# Altium project SimpleNCPower.PrjPcb
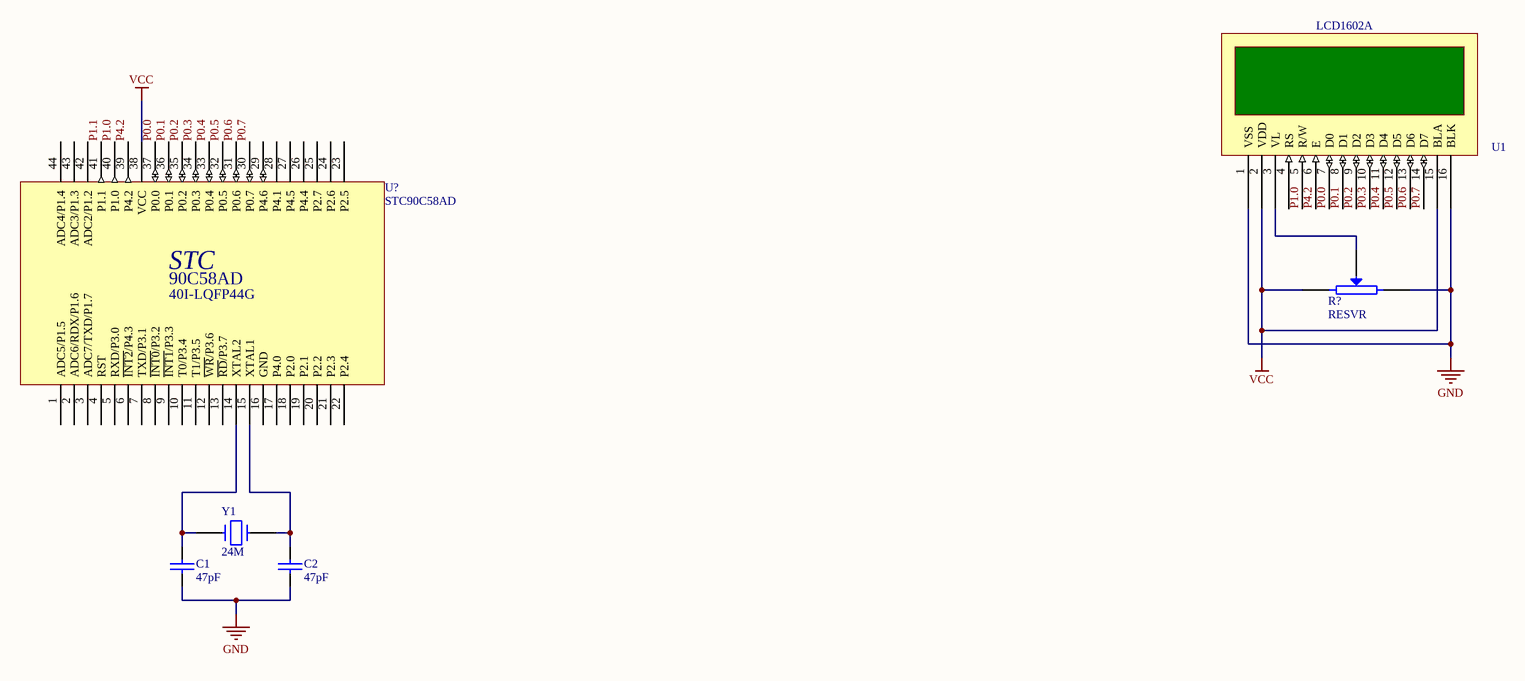
[diagram p0: NCPower.SchDoc]
1 sheet, 6 parts. Net scope: global (net labels, ports and power ports of the same name join across sheets).

## Sheet NCPower.SchDoc
size A3

### Parts
C1  47pF
C2  47pF
R?  RESVR
U1  LCD1602A
U?  STC90C58AD
Y1  24M

### Nets
GND: C1.1 C2.1 R?.2 U1.1(VSS) U1.16(BLK)
VCC: R?.1 U1.2(VDD) U1.15(BLA) U?.38(VCC)
P0.0: U1.7(D0) U?.37(P0.0)
P0.1: U1.8(D1) U?.36(P0.1)
P0.2: U1.9(D2) U?.35(P0.2)
P0.3: U1.10(D3) U?.34(P0.3)
P0.4: U1.11(D4) U?.33(P0.4)
P0.5: U1.12(D5) U?.32(P0.5)
P0.6: U1.13(D6) U?.31(P0.6)
P0.7: U1.14(D7) U?.30(P0.7)
P1.0: U1.5(R/W) U?.40(P1.0)
P1.1: U?.41(P1.1)
P4.2: U1.6(E) U?.39(P4.2)
NetC1_2: C1.2 U?.14(XTAL2) Y1.1
NetC2_2: C2.2 U?.15(XTAL1) Y1.2
NetR?_3: R?.3(W) U1.3(VL)

Not connected (* = marked no-connect by the designer): U1 4(RS); U? 1(ADC5/P1.5) 2(ADC6/RDX/P1.6) 3(ADC7/TXD/P1.7) 4(RST) 5(RXD/P3.0) 6(~{INT2}/P4.3) 7(TXD/P3.1) 8(~{INT0}/P3.2) 9(~{INT1}/P3.3) 10(T0/P3.4) 11(T1/P3.5) 12(~{WR}/P3.6) 13(~{RD}/P3.7) 16(GND) 17(P4.0) 18(P2.0) 19(P2.1) 20(P2.2) 21(P2.3) 22(P2.4) 23(P2.5) 24(P2.6) 25(P2.7) 26(P4.4) 27(P4.5) 28(P4.1) 29(P4.6) 42(ADC2/P1.2) 43(ADC3/P1.3) 44(ADC4/P1.4)

### Notes on the sheet
- (in symbol STC90C58AD) STC; 90C58AD; 40I-LQFP44G

### Library data of the parts
C1 C2 = CAP
Y1 = CRYSTAL